# EAGLE design MHR15-inverter_current_sensors-v1 (EAGLE 6.6.0)
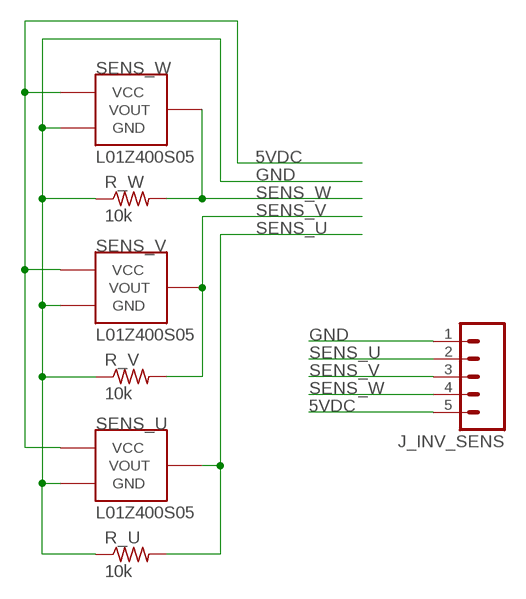
[diagram p0: schematic, sheet 1]

## Parts
J_INV_SENS  M05LOCK  [1X05_LOCK]
R_U  10k  R-US_R0603  [R0603]
R_V  10k  R-US_R0603  [R0603]
R_W  10k  R-US_R0603  [R0603]
SENS_U  L01Z400S05  [L01Z400S05]
SENS_V  L01Z400S05  [L01Z400S05]
SENS_W  L01Z400S05  [L01Z400S05]

## Nets
5VDC: J_INV_SENS.5 SENS_U.VCC SENS_V.VCC SENS_W.VCC
GND: J_INV_SENS.1 R_U.1 R_V.1 R_W.1 SENS_U.GND SENS_V.GND SENS_W.GND
SENS_U: J_INV_SENS.2 R_U.2 SENS_U.VOUT
SENS_V: J_INV_SENS.3 R_V.2 SENS_V.VOUT
SENS_W: J_INV_SENS.4 R_W.2 SENS_W.VOUT

## Library data of the parts
J_INV_SENS = SparkFun-Connectors:M05: Header 5 Standard 5-pin 0.1" header. Use with straight break away headers (SKU : PRT-00116), right angle break away headers (PRT-00553), swiss pins (PRT-00743), machine pins (PRT-00117), and female headers (PRT-00115). Molex polarized connector foot print use with SKU : PRT-08230 with associated crimp pins and housings.
R_U R_V R_W = rcl:R-US_: RESISTOR, American symbol
SENS_U SENS_V SENS_W = MHR15-TS:L01Z400S05: SENSOR CURRENT 400A 5V BI MOD; DIGIKEY_PN: MT7178-ND; MANUFACTURER: Tamura; MFC_PN: L01Z400S05

## Board
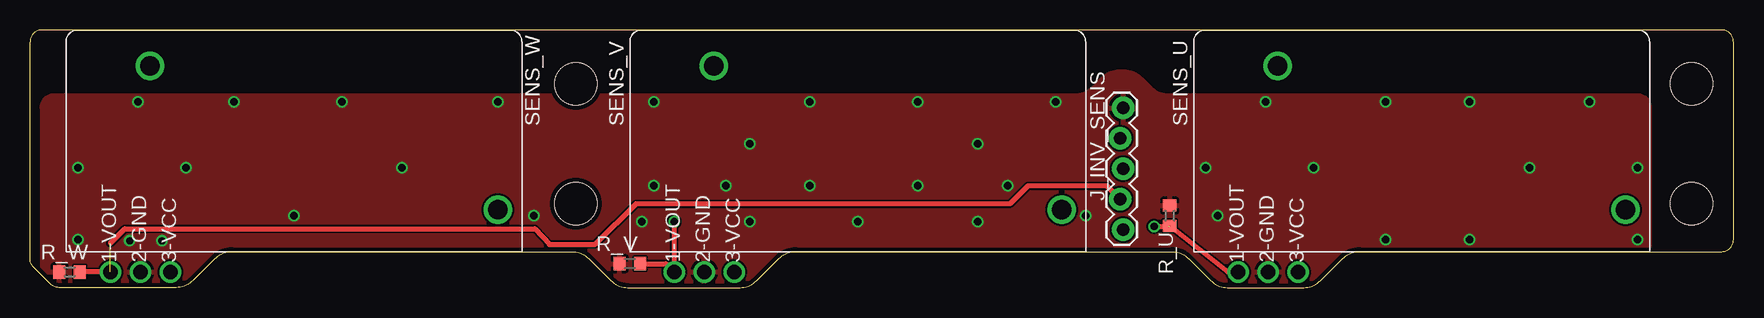
[diagram p1: board, top side]
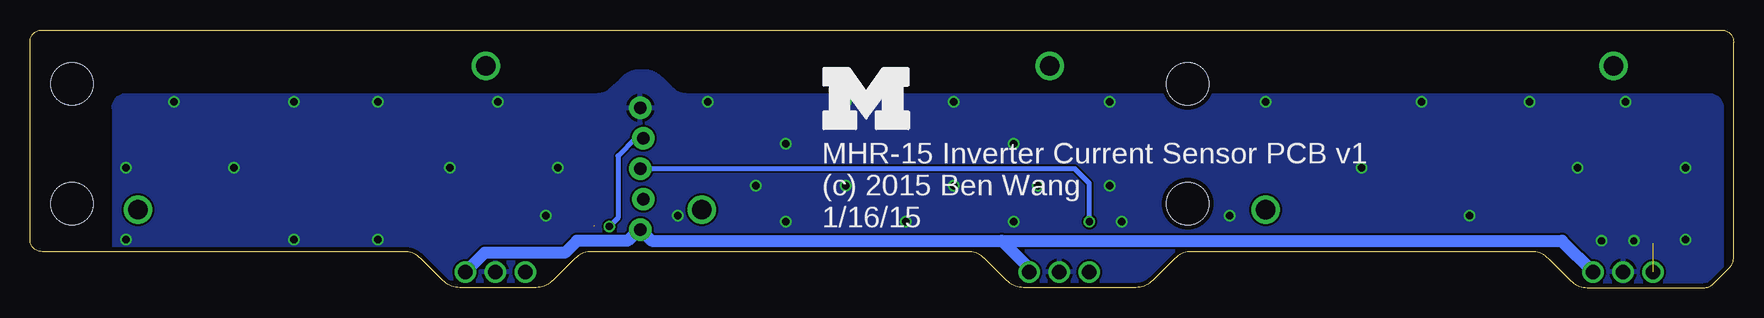
[diagram p2: board, bottom side, seen from below]

Size 142 x 21.5 mm. Coordinates in mm from the lower left corner, seen from the top.
Outline: 141,21.5 1,21.5 arc90 0,20.5 0,2.41 arc45 0.29,1.71 1.71,0.29 arc45 2.41,0 12.17,0 arc45 13.59,0.59 15.41,2.41 arc-45 16.83,3 45.17,3 arc-45 46.59,2.41 48.41,0.59 arc45 49.83,0 59.17,0 arc45 60.59,0.59 62.41,2.41 arc-45 63.83,3 95.17,3 arc-45 96.59,2.41 98.41,0.59 arc45 99.83,0 106.17,0 arc45 107.59,0.59 109.41,2.41 arc-45 110.83,3 141,3 arc90 142,4 142,20.5 arc90 141,21.5
Copper layers (1*16): Top 0.0356mm / dielectric 1.5011mm / Bottom 0.0356mm
Design rules "LaenPCBOrder": minimum track width 6mil, minimum drill 13mil, track to track 6mil, track to pad 6mil, pad to pad 6mil, via to via 6mil, smd to smd 6mil, copper to edge 15mil, drill to drill 6mil, minimum pad ring 7mil, minimum via ring 7mil, stop-mask expansion 3mil, vias tented up to drill 0mil, thermal gap 10mil
Holes 3.5 mm at 45.5,17 45.5,7 138.5,17 138.5,7

### Footprints (pad centres in the part's own frame; a part is rotated, then mirrored left to right if it is on the bottom)
1X05_LOCK = drill 1.016 pad 1.88: 1 0,0.127; 2 2.54,-0.127; 3 5.08,0.127; 4 7.62,-0.127; 5 10.16,0.127
R0603 = smd 1 x 1.1: 1 -0.85,0; 2 0.85,0
L01Z400S05 = drill 1.2: GND -15.3,-5.2; VCC -12.8,-5.2; VOUT -17.8,-5.2 | drill 1.6: MOUNT1 -14.5,12; MOUNT2 14.5,0

### Placement (x,y rotation side)
J_INV_SENS  91,15 270 top
R_U  95,6 270 top
R_V  50,2 0 top
R_W  3.3,1.3 0 top
SENS_U  118.5,6.5 0 top
SENS_V  71.5,6.5 0 top
SENS_W  24.5,6.5 0 top

### Tracks (layer width: path | path; a pad name or v marks a point on that pad's centre or on a via)
5VDC
  Bottom 1.016: SENS_U.VCC 104.1,2.9 97.4,2.9 96.4,3.9 92.2,3.9 91.26,4.84 J_INV_SENS.5 90.19,3.9 61,3.9 | 61,3.9 14.3,3.9 SENS_W.VCC | SENS_V.VCC 58.7,1.6 61,3.9
GND  (via drill 0.6)
  other vias: 4,10 4,4 13,10 31,10 42,6 22,6 60,12 51,5.5 69,5.5 79,12 88,6 98,10 99,6 107,10 120,4 125,10 134,10 134,4 60,5.5 65,8.5 58,8.5 74,8.5 79,5.5 81.5,8.5 85.5,15.5 74,15.5 65,15.5 52,15.5 52,8.5 39,15.5 26,15.5 17,15.5 9,15.5 11,3.9 8.3,3.9 103,15.5 113,15.5 120,15.5 130,15.5 113,4
  pour Bottom: 1,-2 1,15 arc-90 2,16 134,16 arc-90 135,15 135,-2
  pour Top (rank 3): 135,0 135,15 arc90 134,16 2,16 arc90 1,15 1,0
  pour Bottom: 86,16 87.17,16 arc45 88.59,16.59 89,17 89.41,17.41 arc-45 90.83,18 91,18 91.17,18 arc-45 92.59,17.41 93,17 93.41,16.59 arc45 94.83,16 96,16 96,14 86,14
  pour Top: 86,16 87.17,16 arc45 88.59,16.59 89,17 89.41,17.41 arc-45 90.83,18 91,18 91.17,18 arc-45 92.59,17.41 93,17 93.41,16.59 arc45 94.83,16 96,16 96,14 86,14
SENS_U  (via drill 0.6)  (1 unrouted)
  Top 0.406: R_U.2 99.85,1.3 SENS_U.VOUT | v93.7,5.1 94.95,5.1
  Bottom 0.406: J_INV_SENS.2 91.54,12.46 93,11 93,5.8 v93.7,5.1
SENS_V  (via drill 0.6)
  Top 0.406: R_V.2 53,2 SENS_V.VOUT v53.7,5.5
  Bottom 0.406: J_INV_SENS.3 54.92,9.92 53.7,8.7 v53.7,5.5
SENS_W  (1 unrouted)
  Top 0.406: SENS_W.VOUT R_W.2 | 6.7,3.7 7.9,4.9 42.1,4.9 43.3,3.6 47.1,3.6 50.5,7 81.7,7 83.2,8.5 89.75,8.5 J_INV_SENS.4

### Text on the board
bNames: MHR-15 Inverter Current Sensor PCB v1 / (c) 2015 Ben Wang / 1/16/15
bValues: Note: All units are in mm. / Board size: 142x22.5mm
Measures: Note: All units are in mm